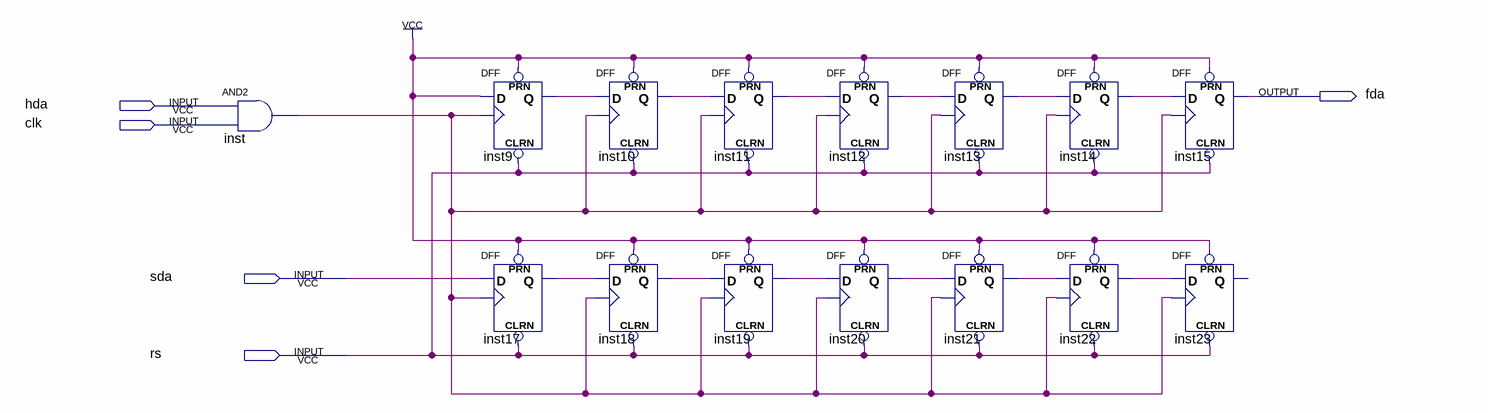
[diagram p0: schematic sheet]
// Quartus schematic dato.bdf as structural Verilog: 15 symbols, 5 pins
module dato (
  input  hda,
  input  clk,
  input  sda,
  input  rs,
  output fda
);

  wire inst9_q, inst10_q, inst11_q, inst12_q, inst13_q, inst14_q, inst17_q, inst18_q, inst19_q, inst20_q,
       inst21_q, inst22_q, inst_out;

  and inst (inst_out, hda, clk);
  DFF inst9 (.CLRN(rs), .CLK(inst_out), .D(1'b1), .PRN(1'b1), .Q(inst9_q));
  DFF inst17 (.CLRN(rs), .CLK(inst_out), .D(sda), .PRN(1'b1), .Q(inst17_q));
  DFF inst10 (.CLRN(rs), .CLK(inst_out), .D(inst9_q), .PRN(1'b1), .Q(inst10_q));
  DFF inst18 (.CLRN(rs), .CLK(inst_out), .D(inst17_q), .PRN(1'b1), .Q(inst18_q));
  DFF inst11 (.CLRN(rs), .CLK(inst_out), .D(inst10_q), .PRN(1'b1), .Q(inst11_q));
  DFF inst19 (.CLRN(rs), .CLK(inst_out), .D(inst18_q), .PRN(1'b1), .Q(inst19_q));
  DFF inst12 (.CLRN(rs), .CLK(inst_out), .D(inst11_q), .PRN(1'b1), .Q(inst12_q));
  DFF inst20 (.CLRN(rs), .CLK(inst_out), .D(inst19_q), .PRN(1'b1), .Q(inst20_q));
  DFF inst13 (.CLRN(rs), .CLK(inst_out), .D(inst12_q), .PRN(1'b1), .Q(inst13_q));
  DFF inst21 (.CLRN(rs), .CLK(inst_out), .D(inst20_q), .PRN(1'b1), .Q(inst21_q));
  DFF inst14 (.CLRN(rs), .CLK(inst_out), .D(inst13_q), .PRN(1'b1), .Q(inst14_q));
  DFF inst22 (.CLRN(rs), .CLK(inst_out), .D(inst21_q), .PRN(1'b1), .Q(inst22_q));
  DFF inst15 (.CLRN(rs), .CLK(inst_out), .D(inst14_q), .PRN(1'b1), .Q(fda));
  DFF inst23 (.CLRN(rs), .CLK(inst_out), .D(inst22_q), .PRN(1'b1));  // open: Q
endmodule
